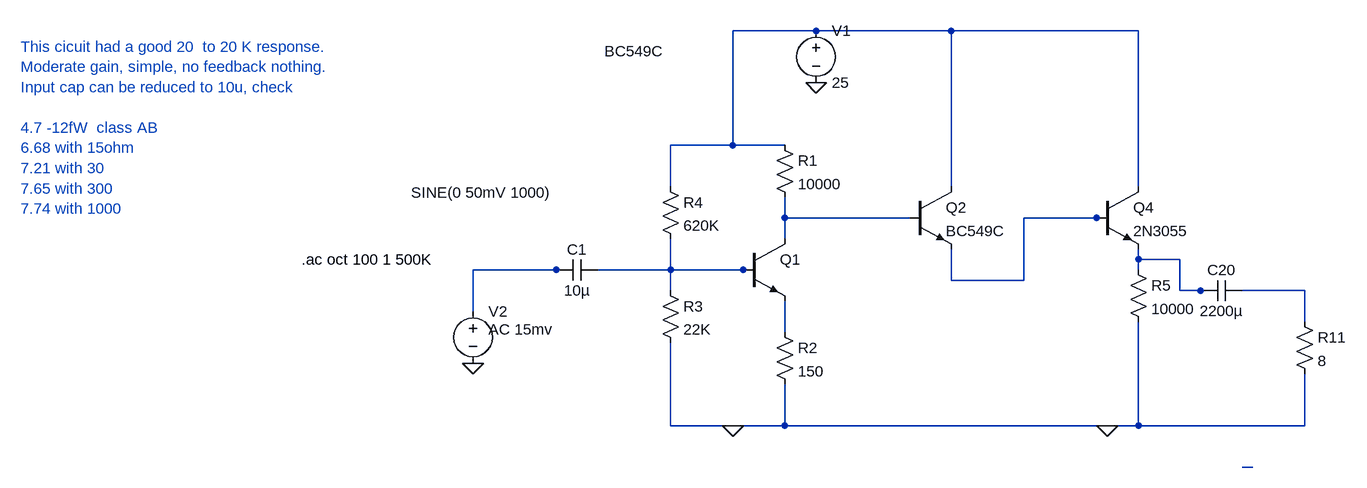
[diagram p0: schematic Pure class A.asc]
Pure class A.asc, the LTspice schematic file:
Version 4
SHEET 1 1788 680
WIRE 272 -256 144 -256
WIRE 480 -256 272 -256
WIRE 768 -256 480 -256
WIRE 144 -80 144 -256
WIRE 144 -80 48 -80
WIRE 224 -80 144 -80
WIRE 48 -16 48 -80
WIRE 480 -16 480 -256
WIRE 768 -16 768 -256
WIRE 224 32 224 0
WIRE 416 32 224 32
WIRE 704 32 592 32
WIRE 720 32 704 32
WIRE 224 64 224 32
WIRE 768 96 768 80
WIRE 832 96 768 96
WIRE -128 112 -256 112
WIRE -112 112 -128 112
WIRE 48 112 48 64
WIRE 48 112 -64 112
WIRE 160 112 48 112
WIRE 176 112 160 112
WIRE 768 112 768 96
WIRE 480 128 480 80
WIRE 592 128 592 32
WIRE 592 128 480 128
WIRE 48 144 48 112
WIRE 832 144 832 96
WIRE 864 144 832 144
WIRE 880 144 864 144
WIRE 1024 144 928 144
WIRE -256 176 -256 112
WIRE 1024 192 1024 144
WIRE 224 208 224 160
WIRE 48 352 48 224
WIRE 144 352 48 352
WIRE 224 352 224 288
WIRE 224 352 144 352
WIRE 720 352 224 352
WIRE 768 352 768 192
WIRE 768 352 720 352
WIRE 1024 352 1024 272
WIRE 1024 352 768 352
WIRE 944 416 928 416
FLAG 272 -176 0
FLAG 144 352 0
FLAG -256 256 0
FLAG 720 352 0
SYMBOL npn 160 64 R0
WINDOW 3 -214 -289 Left 2
SYMATTR Value BC549C
SYMATTR InstName Q1
SYMBOL res 208 -96 R0
SYMATTR InstName R1
SYMATTR Value 10000
SYMBOL voltage 272 -272 R0
WINDOW 123 0 0 Left 2
WINDOW 39 0 0 Left 2
SYMATTR InstName V1
SYMATTR Value 25
SYMBOL res 32 -32 R0
SYMATTR InstName R4
SYMATTR Value 620K
SYMBOL res 32 128 R0
SYMATTR InstName R3
SYMATTR Value 22K
SYMBOL res 208 192 R0
SYMATTR InstName R2
SYMATTR Value 150
SYMBOL cap -64 96 R90
WINDOW 0 0 32 VBottom 2
WINDOW 3 32 32 VTop 2
SYMATTR InstName C1
SYMATTR Value 10µ
SYMBOL voltage -256 160 R0
WINDOW 123 24 44 Left 2
WINDOW 39 24 72 Left 2
WINDOW 3 -95 -167 Left 2
SYMATTR Value2 AC 15mv
SYMATTR Value SINE(0 50mV 1000)
SYMATTR InstName V2
SYMBOL npn2 704 -16 R0
SYMATTR InstName Q4
SYMATTR Value 2N3055
SYMBOL res 1008 176 R0
SYMATTR InstName R11
SYMATTR Value 8
SYMBOL cap 928 128 R90
WINDOW 0 0 32 VBottom 2
WINDOW 3 32 32 VTop 2
SYMATTR InstName C20
SYMATTR Value 2200µ
SYMBOL npn 416 -16 R0
SYMATTR InstName Q2
SYMATTR Value BC549C
SYMBOL res 752 96 R0
SYMATTR InstName R5
SYMATTR Value 10000
TEXT -520 96 Left 2 !.ac oct 100 1 500K
TEXT -952 -232 Left 2 ;This cicuit had a good 20  to 20 K response. \nModerate gain, simple, no feedback nothing.\nInput cap can be reduced to 10u, check\n \n4.7 -12fW  class AB\n6.68 with 15ohm\n7.21 with 30\n7.65 with 300\n7.74 with 1000

The netlist it stands for:
* Pure class A.asc
Q1 N002 N006 N008 0 BC549C
R1 N001 N002 10000
V1 N001 0 25
R4 N001 N006 620K
R3 N006 0 22K
R2 N008 0 150
C1 N006 N005 10µ
V2 N005 0 SINE(0 50mV 1000) AC 15mv
Q4 N001 N003 N004 0 2N3055
R11 N007 0 8
C20 N007 N004 2200µ
Q2 N001 N002 N003 0 BC549C
R5 N004 0 10000
.model NPN NPN
.model PNP PNP
.lib standard.bjt
.ac oct 100 1 500K
* This cicuit had a good 20  to 20 K response.
* Moderate gain, simple, no feedback nothing.
* Input cap can be reduced to 10u, check
* 4.7 -12fW  class AB
* 6.68 with 15ohm
* 7.21 with 30
* 7.65 with 300
* 7.74 with 1000
.backanno
.end